# EAGLE schematic Lusso (EAGLE 9.0.0)
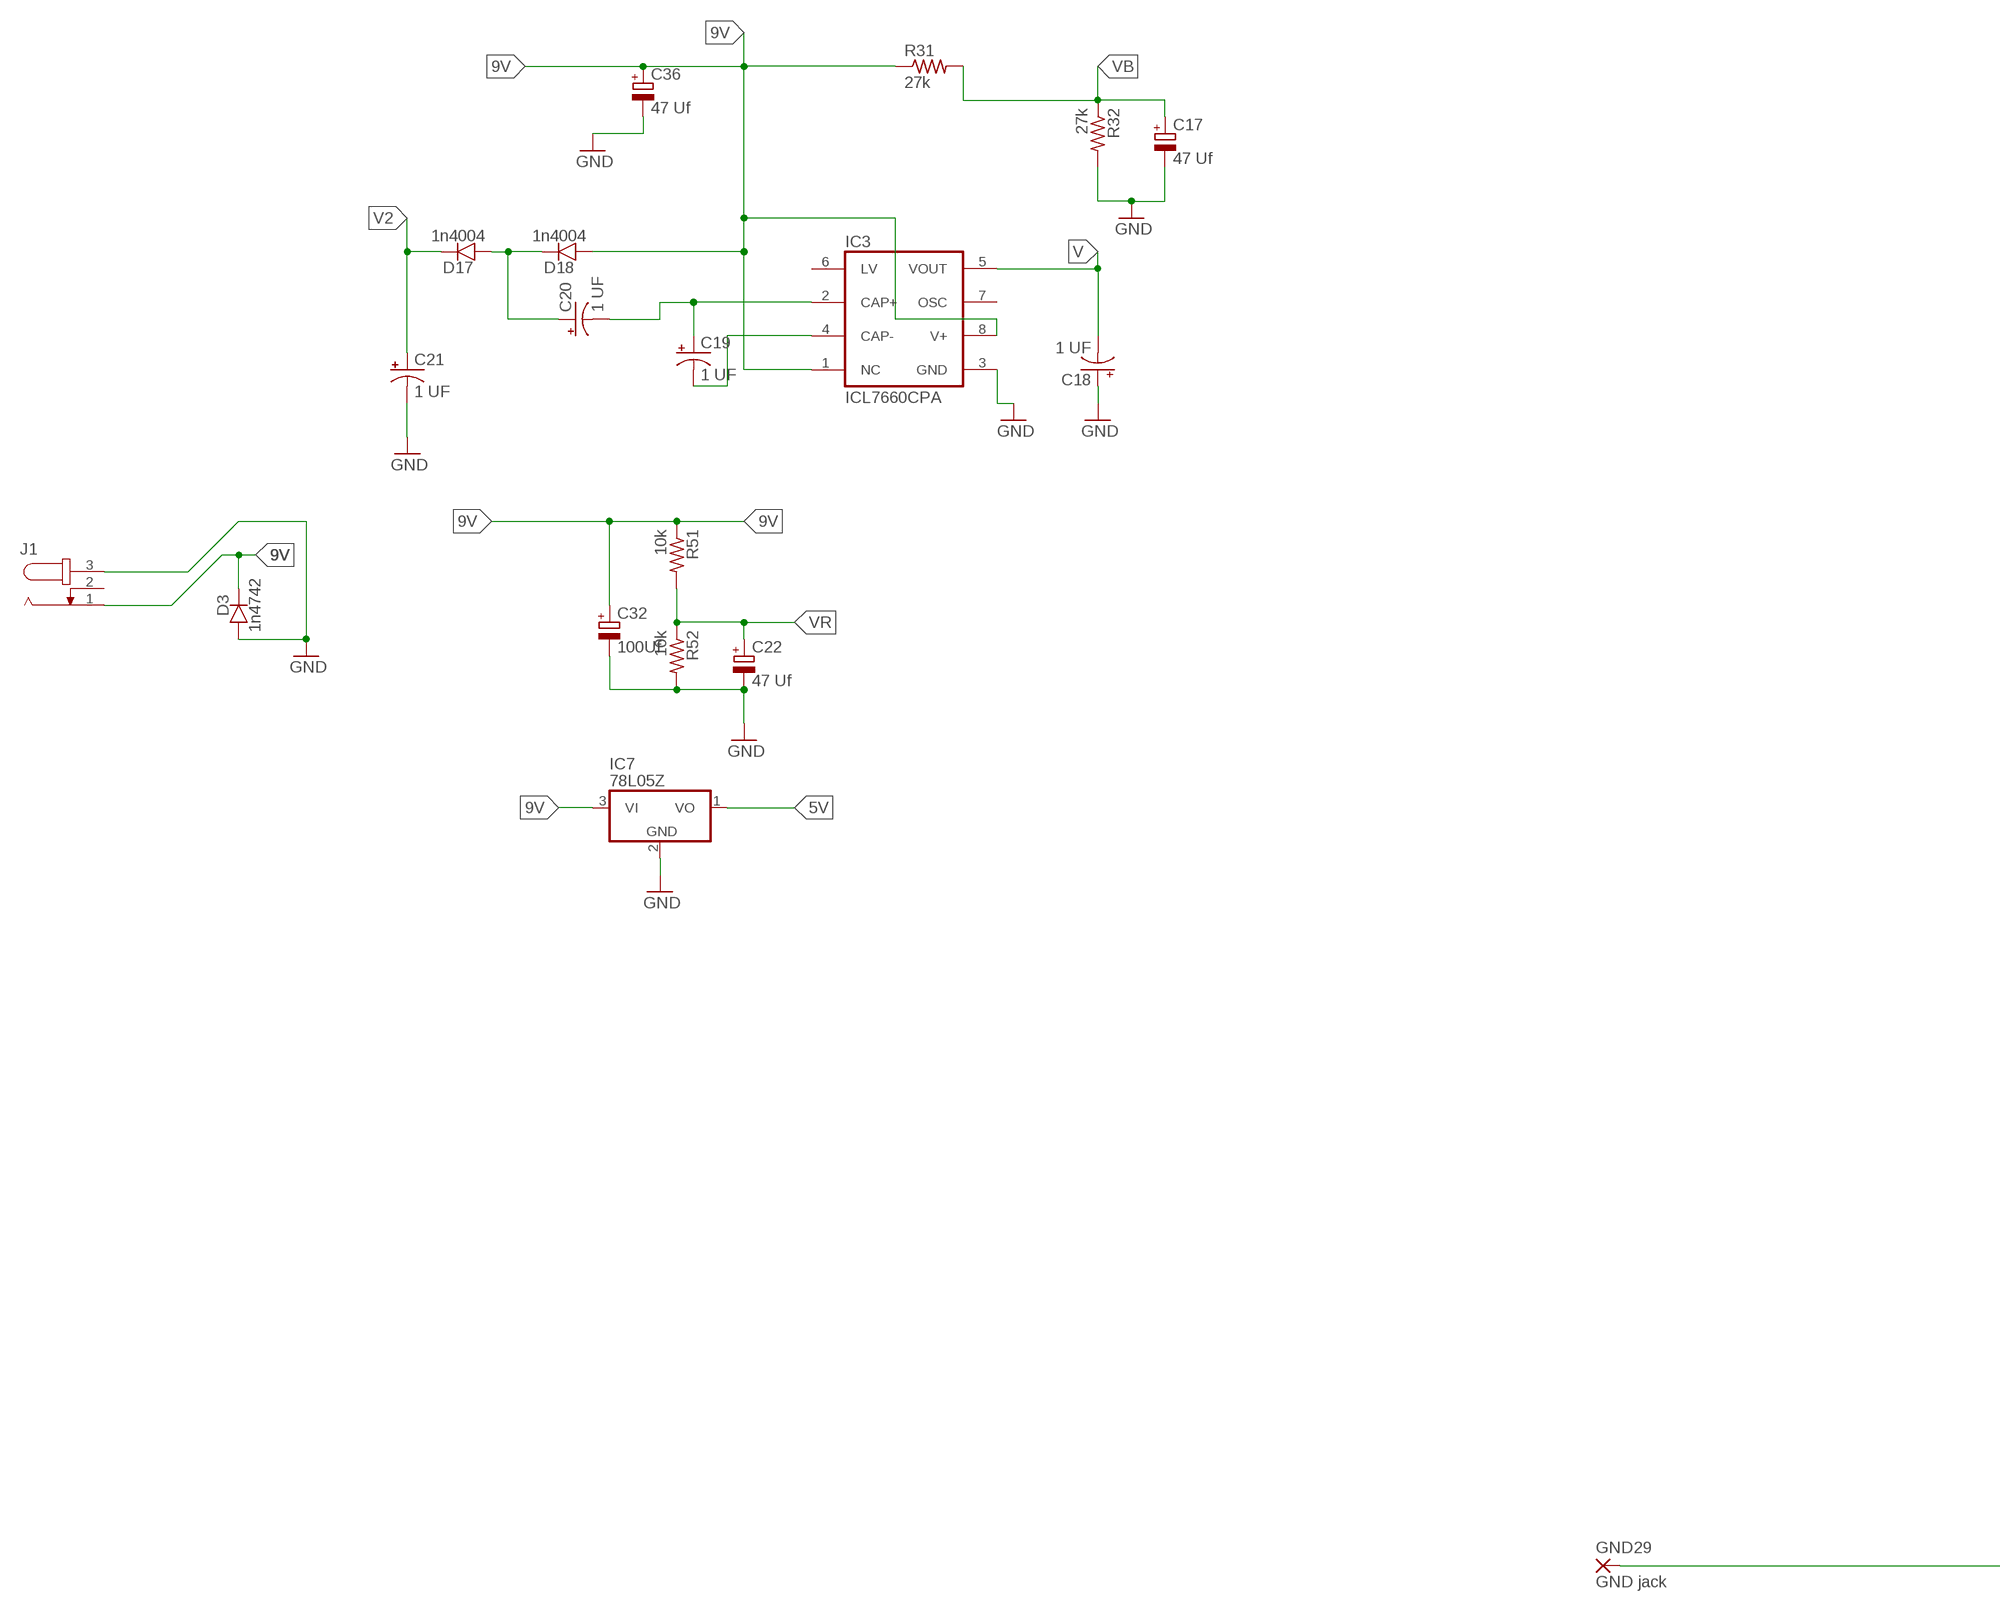
[diagram p0: schematic, sheet 1, part 1 of 2]
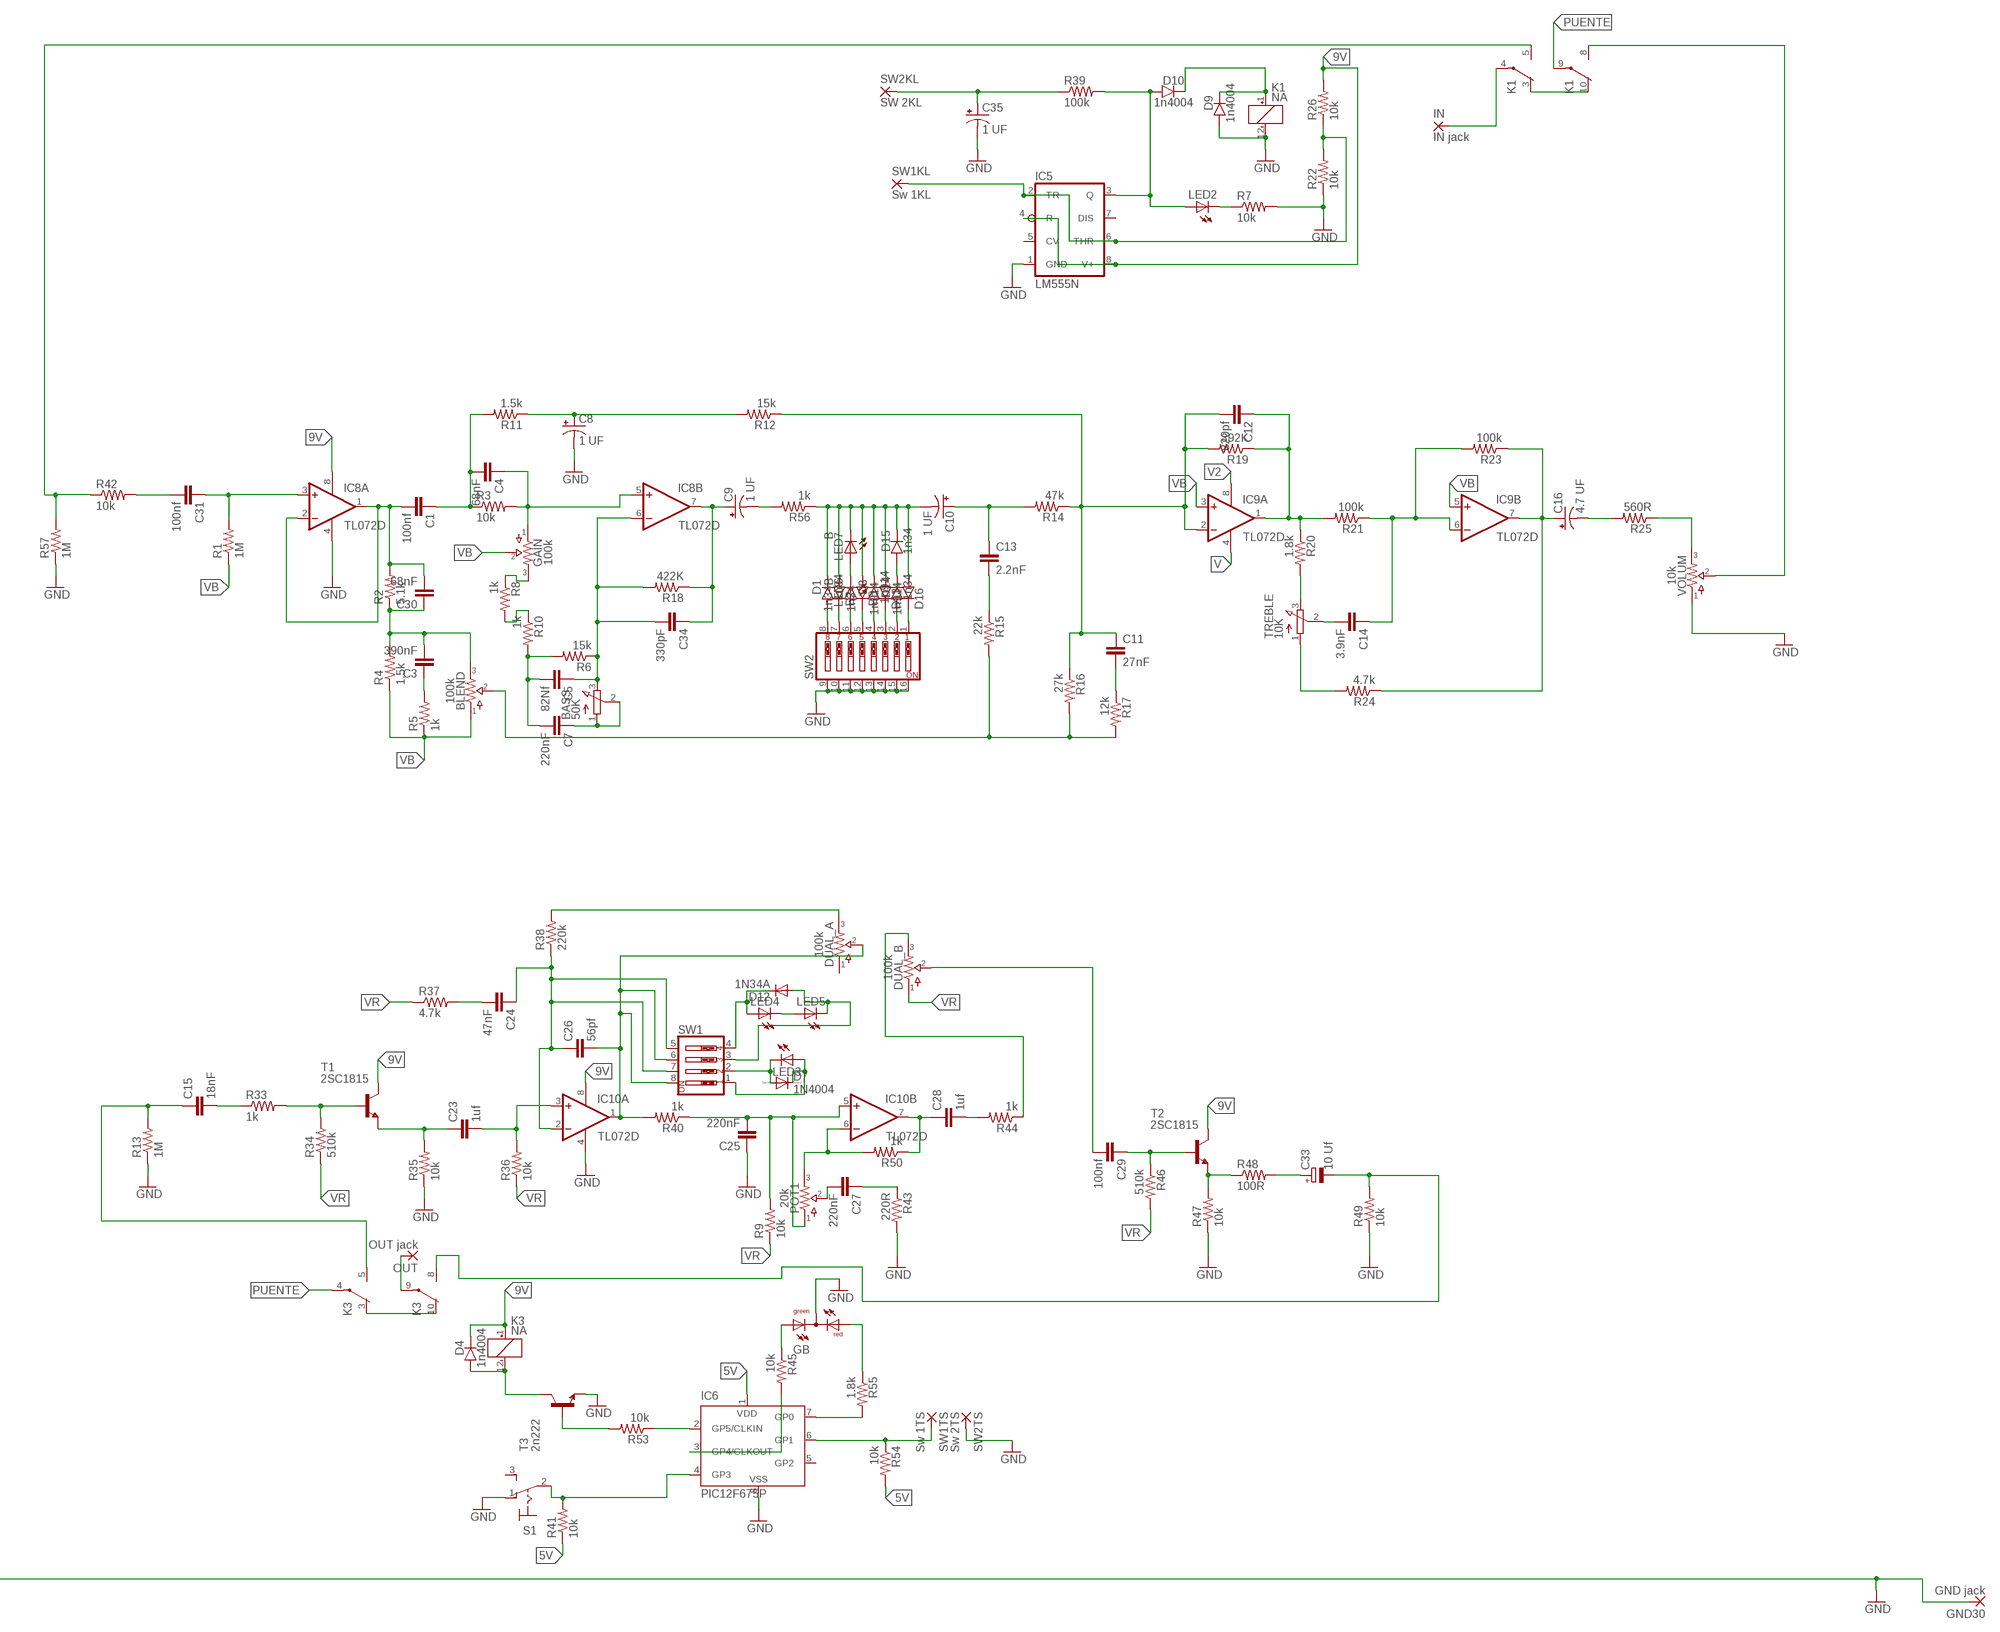
[diagram p1: schematic, sheet 1, part 2 of 2]

## Parts
BASS  50K  EVUF2A  [EVUF]
BLEND  100k  16MM.1  [16MM_B.MOUNT]
C1  100nf  C-EUC0805  [C0805]
C3  390nF  C2,5-3  [C2.5-3]
C4  68nF  C-EUC0805  [C0805]
C5  82Nf  C2,5-3  [C2.5-3]
C7  220nF  C-EUC0805  [C0805]
C8  1 UF  CPOL-USB45181A  [B45181A]
C9  1 UF  CPOL-USB45181A  [B45181A]
C10  1 UF  CPOL-USB45181A  [B45181A]
C11  27nF  C2,5-3  [C2.5-3]
C12  820pf  C-EUC0805  [C0805]
C13  2.2nF  C2,5-3  [C2.5-3]
C14  3.9nF  C-EUC0805  [C0805]
C15  18nF  C2,5-3  [C2.5-3]
C16  4.7 UF  CPOL-USB45181A  [B45181A]
C17  47 Uf  CPOL-EUB  [PANASONIC_B]
C18  1 UF  CPOL-USB45181A  [B45181A]
C19  1 UF  CPOL-USB45181A  [B45181A]
C20  1 UF  CPOL-USB45181A  [B45181A]
C21  1 UF  CPOL-USB45181A  [B45181A]
C22  47 Uf  CPOL-EUB  [PANASONIC_B]
C23  1uf  C-EUC1206  [C1206]
C24  47nF  C-EUC0805  [C0805]
C25  220nF  C-EUC0805  [C0805]
C26  56pf  C-EUC0805  [C0805]
C27  220nF  C-EUC0805  [C0805]
C28  1uf  C-EUC1206  [C1206]
C29  100nf  C-EUC0805  [C0805]
C30  68nF  C-EUC0805  [C0805]
C31  100nf  C-EUC0805  [C0805]
C32  100Uf  CPOL-EUB  [PANASONIC_B]
C33  10 Uf  CPOL-EUB  [PANASONIC_B]
C34  330pF  C-EUC0805  [C0805]
C35  1 UF  CPOL-USB45181A  [B45181A]
C36  47 Uf  CPOL-EUB  [PANASONIC_B]
D1  1n34  DO35.3  [DO35-3]
D2  1n34  DO35.3  [DO35-3]
D3  1n4742  DO35.3  [DO35-3]
D4  1n4004  DO35.3  [DO35-3]
D5  1n34  DO35.3  [DO35-3]
D7  1N4004  [DO41-10]
D8  1n914  DO35.3  [DO35-3]
D9  1n4004  DO35.3  [DO35-3]
D10  1n4004  DO35.3  [DO35-3]
D12  1N34A  1N4004  [DO41-10]
D13  1n914  DO35.3  [DO35-3]
D14  1n34  DO35.3  [DO35-3]
D15  1n34  DO35.3  [DO35-3]
D16  1n914  DO35.3  [DO35-3]
D17  1n4004  DO35.3  [DO35-3]
D18  1n4004  DO35.3  [DO35-3]
DUAL  100k  DUALGANG.2  [16MM_DUALGANG]
GAIN  100k  16MM.1  [16MM_B.MOUNT]
GB  DUOLED-RG-C  [DUOLED-C-5MM]
GND29  GND jack  2,15/1,0  [2,15/1,0]
GND30  GND jack  2,15/1,0  [2,15/1,0]
IC3  ICL7660CPA  [DIL08]
IC5  LM555N  [DIL08]
IC6  PIC12F675P  [DIL8]
IC7  78L05Z  [TO92]
IC8  TL072D  [SO08]
IC9  TL072D  [SO08]
IC10  TL072D  [SO08]
IN  IN jack  2,15/1,0  [2,15/1,0]
J1  JACK-PLUG0  [SPC4077]
K1  NA  [NA]
K3  NA  [NA]
LED2  LED5MM  [LED5MM]
LED3  LED5MM  [LED5MM]
LED4  LED5MM  [LED5MM]
LED5  LED5MM  [LED5MM]
LED6  B  LED5MM  [LED5MM]
LED7  B  LED5MM  [LED5MM]
OUT  OUT jack  2,15/1,0  [2,15/1,0]
POT1  20k  TRIMMER  [TRIM1]
R1  1M  R-US_R1206  [R1206]
R2  5.1k  R-US_M0805  [M0805]
R3  10k  R-US_M0805  [M0805]
R4  1.5k  R-US_M0805  [M0805]
R5  1k  R-US_M0805  [M0805]
R6  15k  R-US_M0805  [M0805]
R7  10k  R-US_M0805  [M0805]
R8  1k  R-US_M0805  [M0805]
R9  10k  R-US_M0805  [M0805]
R10  1k  R-US_M0805  [M0805]
R11  1.5k  R-US_M0805  [M0805]
R12  15k  R-US_M0805  [M0805]
R13  1M  R-US_R1206  [R1206]
R14  47k  R-US_M0805  [M0805]
R15  22k  R-US_M0805  [M0805]
R16  27k  R-US_M0805  [M0805]
R17  12k  R-US_M0805  [M0805]
R18  422K  R-US_0204/7  [0204/7]
R19  392K  R-US_0204/7  [0204/7]
R20  1.8k  R-US_M0805  [M0805]
R21  100k  R-US_M0805  [M0805]
R22  10k  R-US_M0805  [M0805]
R23  100k  R-US_M0805  [M0805]
R24  4.7k  R-US_M0805  [M0805]
R25  560R  R-US_M0805  [M0805]
R26  10k  R-US_M0805  [M0805]
R31  27k  R-US_M0805  [M0805]
R32  27k  R-US_M0805  [M0805]
R33  1k  R-US_M0805  [M0805]
R34  510k  R-US_M0805  [M0805]
R35  10k  R-US_M0805  [M0805]
R36  10k  R-US_M0805  [M0805]
R37  4.7k  R-US_M0805  [M0805]
R38  220k  R-US_M0805  [M0805]
R39  100k  R-US_M0805  [M0805]
R40  1k  R-US_M0805  [M0805]
R41  10k  R-US_M0805  [M0805]
R42  10k  R-US_M0805  [M0805]
R43  220R  R-US_M0805  [M0805]
R44  1k  R-US_M0805  [M0805]
R45  10k  R-US_M0805  [M0805]
R46  510k  R-US_M0805  [M0805]
R47  10k  R-US_M0805  [M0805]
R48  100R  R-US_M0805  [M0805]
R49  10k  R-US_M0805  [M0805]
R50  1k  R-US_M0805  [M0805]
R51  10k  R-US_M0805  [M0805]
R52  10k  R-US_M0805  [M0805]
R53  10k  R-US_M0805  [M0805]
R54  10k  R-US_M0805  [M0805]
R55  1.8k  R-US_M0805  [M0805]
R56  1k  R-US_M0805  [M0805]
R57  1M  R-US_R1206  [R1206]
S1  320-916  [320-916]
SW1  SW_DIP-4  [EDG-04]
SW1KL  Sw 1KL  2,15/1,0  [2,15/1,0]
SW1TS  Sw 1TS  2,15/1,0  [2,15/1,0]
SW2  SW_DIP-8  [EDG-08]
SW2KL  SW 2KL  2,15/1,0  [2,15/1,0]
SW2TS  Sw 2TS  2,15/1,0  [2,15/1,0]
T1  2SC1815  [TO92-ECB]
T2  2SC1815  [TO92-ECB]
T3  2n222  2N2222-NPN-TO18-EBC  [TO18]
TREBLE  10K  EVUF2A  [EVUF]
VOLUM  10k  16MM.1  [16MM_B.MOUNT]

## Nets
5V: IC6.1(VDD) IC7.1(VO) R41.1 R54.2
9V: C32.+ C36.+ D3.C D4.C D18.A IC3.1(NC) IC3.8(V+) IC5.4(R) IC5.8(V+) IC7.3(VI) IC8.8(P:V+) IC10.8(P:V+) J1.1 K3.1(1:+) R26.2 R31.1 R51.1 T1.C T2.C
GND: C8.- C17.- C18.+ C21.- C22.- C25.1 C32.- C35.- C36.- D3.A D9.A GB.C GND29.1(P) GND30.1(P) IC3.3(GND) IC5.1(GND) IC6.8(VSS) IC7.2(GND) IC8.4(P:V-) IC10.4(P:V-) J1.3 K1.12(1:-) R7.2 R13.1 R22.1 R32.2 R35.1 R43.2 R47.1 R49.1 R52.2 R57.1 S1.1(O) SW2.9 SW2.10 SW2.11 SW2.12 SW2.13 SW2.14 SW2.15 SW2.16 SW2TS.1(P) T3.1(E) VOLUM.1
N$1: C31.2 R42.2
N$2: C31.1 IC8.3(A:+IN) R1.2
N$3: C1.2 C30.2 IC8.1(A:OUT) IC8.2(A:-IN) R2.2
N$4: BLEND.3 C3.2 C30.1 R2.1 R4.2
N$5: BASS.1(A) BASS.2(S) C7.1
N$6: C3.1 R5.2
N$7: C1.1 C4.2 R3.1 R11.2
N$8: C4.1 GAIN.1 IC8.5(B:+IN) R3.2
N$9: GAIN.3 R8.1
N$10: C5.2 C7.2 R6.2 R10.2
N$11: BASS.3(E) C5.1 C34.2 IC8.6(B:-IN) R6.1 R18.2
N$12: C12.1 IC9.1(A:OUT) R19.1 R20.1 R21.2
N$13: K3.3(2:O) K3.10(3:O)
N$14: C8.+ R11.1 R12.2
N$15: R20.2 TREBLE.3(E)
N$16: C9.+ C34.1 IC8.7(B:OUT) R18.1
N$17: C9.- R56.2
N$18: C10.- D1.C D2.A D5.A D8.C D13.A D15.C D16.A LED7.K(C) R56.1
N$19: C14.2 TREBLE.2(S)
N$20: C10.+ C13.1 R14.2
N$21: C13.2 R15.1
N$22: C11.2 R17.1
N$23: C11.1 C12.2 IC9.2(A:-IN) R12.1 R14.1 R16.1 R19.2
N$24: BLEND.2 R15.2 R16.2 R17.2
N$25: C14.1 IC9.6(B:-IN) R21.1 R23.2
N$26: C16.+ IC9.7(B:OUT) R23.1 R24.1
N$27: C16.- R25.2
N$28: R25.1 VOLUM.3
N$29: K1.3(2:O) K1.10(3:O)
N$30: R8.2 R10.1
N$31: K1.8(3:S) VOLUM.2
N$32: R24.2 TREBLE.1(A)
N$33: DUAL.3 R38.2
N$34: DUAL.6 R44.1
N$35: C15.2 R33.1
N$36: C20.+ D17.A D18.C
N$37: C29.2 DUAL.5
N$38: C19.+ C20.- IC3.2(CAP+)
N$39: IC5.2(TR) IC5.6(THR) R22.2 R26.1 SW1KL.1(P)
N$40: LED2.K(C) R7.1
N$41: IC6.4(GP3) R41.2 S1.2(P)
N$42: C35.+ R39.1 SW2KL.1(P)
N$43: D10.A IC5.3(Q) LED2.A R39.2
N$44: D9.C D10.C K1.1(1:+)
N$45: IC6.2(GP5/CLKIN) R53.1
N$46: D1.A SW2.8
N$47: R33.2 R34.2 T1.B
N$48: R53.2 T3.2(B)
N$49: D4.A K3.12(1:-) T3.3(C)
N$50: C23.1 R35.2 T1.E
N$51: D2.C SW2.7
N$52: IC6.3(GP4/CLKOUT) R45.2
N$53: C24.1 C26.1 IC10.2(A:-IN) R38.1 SW1.5 SW1.7
N$54: C26.2 DUAL.2 IC10.1(A:OUT) R40.2 SW1.6 SW1.8
N$55: IC6.6(GP1) R54.1 SW1TS.1(P)
N$56: C24.2 R37.2
N$57: IC6.7(GP0) R55.2
N$58: C25.2 IC10.5(B:+IN) POT1.1 R9.2 R40.1
N$59: GB.AX(AG) R45.1
N$60: IC10.6(B:-IN) POT1.3 R50.2
N$61: C27.2 POT1.2
N$62: C27.1 R43.1
N$63: C28.1 IC10.7(B:OUT) R50.1
N$64: C28.2 R44.2
N$65: GB.AR R55.1
N$66: D12.C LED4.A SW1.4
N$67: C29.1 R46.1 T2.B
N$68: R47.2 R48.1 T2.E
N$69: LED4.K(C) LED5.A
N$70: C33.+ R48.2
N$71: C33.- K3.8(3:S) R49.2
N$72: D12.A LED5.K(C) SW1.3
N$73: D7.A LED3.K(C) SW1.2
N$74: D7.C LED3.A SW1.1
N$75: LED6.A SW2.6
N$76: LED6.K(C) LED7.A
N$77: C23.2 IC10.3(A:+IN) R36.2
N$78: D5.C SW2.5
N$79: D8.A SW2.4
N$80: C19.- IC3.4(CAP-)
N$81: D13.C SW2.3
N$82: D14.C D15.A
N$83: D14.A SW2.2
N$84: D16.C SW2.1
N$85: C15.1 K3.5(2:S) R13.2
N$86: K1.5(2:S) R42.1 R57.2
N$87: IN.1(P) K1.4(2:P)
N$88: K3.9(3:P) OUT.1(P)
PUENTE: K1.9(3:P) K3.4(2:P)
V: C18.- IC3.5(VOUT) IC9.4(P:V-)
V2: C21.+ D17.C IC9.8(P:V+)
VB: BLEND.1 C17.+ GAIN.2 IC9.3(A:+IN) IC9.5(B:+IN) R1.1 R4.1 R5.1 R31.2 R32.1
VR: C22.+ DUAL.4 R9.1 R34.1 R36.1 R37.1 R46.2 R51.2 R52.1
Unconnected: DUAL.1 IC3.6(LV) IC3.7(OSC) IC5.5(CV) IC5.7(DIS) IC6.5(GP2) J1.2 S1.3(S)

## Library data of the parts
BASS TREBLE = pot:EVU: 9 mm Square Rotary Potentiometers Source: Panasonic
BLEND GAIN VOLUM = potentiometers:16MM: 16mm Poteniometers
C1 C4 C7 C12 C14 C23-C31 C34 = resistor:C-EU: CAPACITOR, European symbol
C3 C5 C11 C13 C15 = capacitor-wima:C: CAPACITOR naming: grid - package width
C8-C10 C16 C18-C21 C35 = rcl:CPOL-US: POLARIZED CAPACITOR, American symbol; SPICEPREFIX: C
C17 C22 C32 C33 C36 = rcl:CPOL-EU: POLARIZED CAPACITOR, European symbol; SPICEPREFIX: C
D1-D5 D8-D10 D13-D18 = diodes:DO35: 1n914, BAT4x, 1n34a Small Signal, Schottky and Germanium Diodes, DO-35 Package 1n914: http://smallbear-electronics.mybigcommerce.com/diode-1n914/ BAT41: http://smallbear-electronics.mybigcommerce.com/diode-schottky-bat41/ 1n34a: http://smallbear-electronics.mybigcommerce.com/diode-nos-germanium/
D7 D12 = diode:1N4004: DIODE general purpose rectifier, 1 A
DUAL = potentiometers:DUALGANG: Dual-Gan Potentiometers
GB = led:DUOLED-RG-C: DUO LED 2 colors (red/green), 5 mm, round, common Cathode www.ligitek.com or other producers.
GND29 GND30 IN OUT SW1KL SW1TS SW2KL SW2TS = wirepad:2,15/1,0: THROUGH-HOLE PAD
IC3 = maxim:ICL7660CPA: VOLTAGE CONVERTER; MF: INTERSIL; MPN: ICL7660CPA; OC_FARNELL: 1018170; OC_NEWARK: 06F7441
IC5 = linear:*555: TIMER
IC6 = microchip:PIC12F6*: Data Sheet 8-Pin FLASH-Based 8-Bit CMOS Microcontrollers Source: http://www.microchip.com .. 41190c.pdf; MF: MICROCHIP; MPN: PIC12F675-E/P; OC_FARNELL: 9759018; OC_NEWARK: 92C4340
IC7 = linear:78*: Positive VOLTAGE REGULATOR Source: http://cache.national.com/ds/LM/LM78L05.pdf http://www.fairchildsemi.com/ds/LM/LM7805.pdf
IC8-IC10 = linear:TL072: OP AMP
J1 = con-jack:JACK-PLUG: DC POWER JACK Power Jack, DC, Right Angle, Through Hole, Rated 5A at 16VDC, PC Terminals Distributor: Farnell (www.Farnell.de) Drawing: 84N1161.pdf / 84N1162.pdf Manufacturer: SPC Technology (www.spctechnology.com) Type: SPC4077 / SPC 4078; OC_FARNELL: unknown; OC_NEWARK: unknown
K1 K3 = relay:NA: RELAY; OC_FARNELL: unknown; OC_NEWARK: unknown
LED2-LED7 = led:LED: LED OSRAM: - CHIPLED LG R971, LG N971, LY N971, LG Q971, LY Q971, LO R971, LY R971 LH N974, LH R974 LS Q976, LO Q976, LY Q976 LO Q996 - Hyper CHIPLED LW Q18S LB Q993, LB Q99A, LB R99A - SideLED LS A670, LO A670, LY A670, LG A670, LP A670 LB A673, LV A673, LT A673, LW A673 LH A674 LY A675 LS A676, LA A676, LO A676, LY A676, LW A676 LS A679, LY A679, LG A679 - Hyper Micro SIDELED® LS Y876, LA Y876, LO Y876, LY Y876 LT Y87S - SmartLED LW L88C, LW L88S LB L89C, LB L89S, LG L890 LS L89K, LO L89K, LY L89K LS L896, LA L896, LO L896, LY L896 - TOPLED LS T670, LO T670, LY T670, LG T670, LP T670 LSG T670, LSP T670, LSY T670, LOP T670, LYG T670 LG T671, LOG T671, LSG T671 LB T673, LV T673, LT T673, LW T673 LH T674 LS T676, LA T676, LO T676, LY T676, LB T676, LH T676, LSB T676, LW T676 LB T67C, LV T67C, LT T67C, LS T67K, LO T67K, LY T67K, LW E67C LS E67B, LA E67B, LO E67B, LY E67B, LB E67C, LV E67C, LT E67C LW T67C LS T679, LY T679, LG T679 LS T770, LO T770, LY T770, LG T770, LP T770 LB T773, LV T773, LT T773, LW T773 LH T774 LS E675, LA E675, LY E675, LS T675 LS T776, LA T776, LO T776, LY T776, LB T776 LHGB T686 LT T68C, LB T68C - Hyper Mini TOPLED® LB M676 - Mini TOPLED Santana® LG M470 LS M47K, LO M47K, LY M47K Source: http://www.osram.convergy.de LUXEON: - LUMILED® LXK2-PW12-R00, LXK2-PW12-S00, LXK2-PW14-U00, LXK2-PW14-V00 LXK2-PM12-R00, LXK2-PM12-S00, LXK2-PM14-U00 LXK2-PE12-Q00, LXK2-PE12-R00, LXK2-PE12-S00, LXK2-PE14-T00, LXK2-PE14-U00 LXK2-PB12-K00, LXK2-PB12-L00, LXK2-PB12-M00, LXK2-PB14-N00, LXK2-PB14-P00, LXK2-PB14-Q00 LXK2-PR12-L00, LXK2-PR12-M00, LXK2-PR14-Q00, LXK2-PR14-R00 LXK2-PD12-Q00, LXK2-PD12-R00, LXK2-PD12-S00 LXK2-PH12-R00, LXK2-PH12-S00 LXK2-PL12-P00, LXK2-PL12-Q00, LXK2-PL12-R00 Source: www.luxeon.com KINGBRIGHT: KA-3528ASYC Source: www.kingbright.com
POT1 = potentiometers:TRIMMER: Trimpots
R1-R26 R31-R57 = rcl:R-US_: RESISTOR, American symbol; SPICEPREFIX: R
S1 = switch:320-916: TOGGLE SWITCH distributor RS Components
SW1 = special:SW_DIP-4: DIP SWITCH
SW2 = special:SW_DIP-8: DIP SWITCH
T1 T2 = transistor:2SC1815: NPN EPITAXIAL TRANSISTOR Source: TOSHIBA .. 2SC1815 1.pdf
T3 = transistor:*-NPN-: NPN Transistror BF959 corrected 2008.03.06